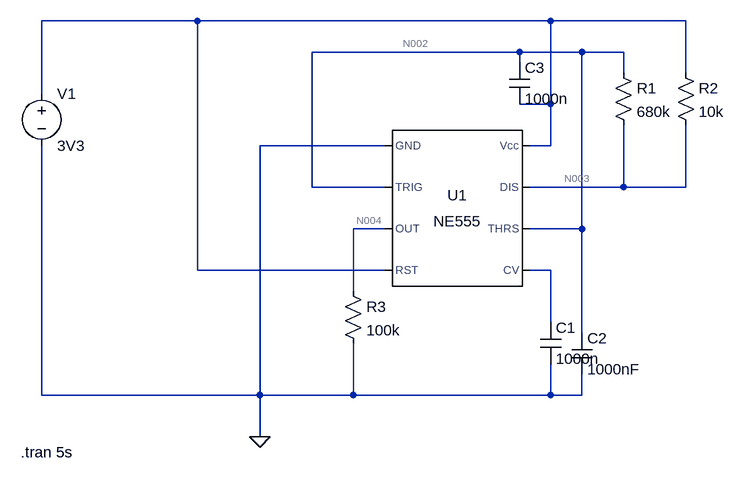
[diagram p0: schematic ts555-timer.asc]
ts555-timer.asc, the LTspice schematic file:
Version 4
SHEET 1 880 680
WIRE -224 -112 -464 -112
WIRE 320 -112 -224 -112
WIRE 528 -112 320 -112
WIRE 272 -64 -48 -64
WIRE 368 -64 272 -64
WIRE 432 -64 368 -64
WIRE 272 -48 272 -64
WIRE 432 -32 432 -64
WIRE 528 -32 528 -112
WIRE -464 0 -464 -112
WIRE 320 16 320 -112
WIRE 320 16 272 16
WIRE 64 80 -128 80
WIRE 320 80 320 16
WIRE 320 80 288 80
WIRE -48 144 -48 -64
WIRE 64 144 -48 144
WIRE 432 144 432 48
WIRE 432 144 288 144
WIRE 528 144 528 48
WIRE 528 144 432 144
WIRE 64 208 16 208
WIRE 368 208 368 -64
WIRE 368 208 288 208
WIRE -224 272 -224 -112
WIRE 64 272 -224 272
WIRE 320 272 288 272
WIRE 16 304 16 208
WIRE 320 352 320 272
WIRE 368 368 368 208
WIRE -464 464 -464 80
WIRE -128 464 -128 80
WIRE -128 464 -464 464
WIRE 16 464 16 384
WIRE 16 464 -128 464
WIRE 320 464 320 416
WIRE 320 464 16 464
WIRE 368 464 368 432
WIRE 368 464 320 464
WIRE -128 528 -128 464
FLAG -128 528 0
SYMBOL Misc\\NE555 176 176 R0
SYMATTR InstName U1
SYMBOL voltage -464 -16 R0
WINDOW 123 0 0 Left 2
WINDOW 39 0 0 Left 2
SYMATTR InstName V1
SYMATTR Value 3V3
SYMBOL cap 304 352 R0
SYMATTR InstName C1
SYMATTR Value 1000n
SYMBOL res 416 -48 R0
SYMATTR InstName R1
SYMATTR Value 680k
SYMBOL cap 352 368 R0
SYMATTR InstName C2
SYMATTR Value 1000nF
SYMBOL res 512 -48 R0
SYMATTR InstName R2
SYMATTR Value 10k
SYMBOL res 0 288 R0
SYMATTR InstName R3
SYMATTR Value 100k
SYMBOL cap 256 -48 R0
SYMATTR InstName C3
SYMATTR Value 1000n
TEXT -496 552 Left 2 !.tran 5s

The netlist it stands for:
* ts555-timer.asc
XU1 0 N002 N004 N001 N005 N002 N003 N001 NE555  ; pins GND TRIG OUT RST CV THRS DIS Vcc
V1 N001 0 3V3
C1 N005 0 1000n
R1 N002 N003 680k
C2 N002 0 1000nF
R2 N001 N003 10k
R3 N004 0 100k
C3 N002 N001 1000n
.tran 5s
.lib NE555.sub
.backanno
.end

* Results of the author's LTspice run, read from the files saved beside the schematic
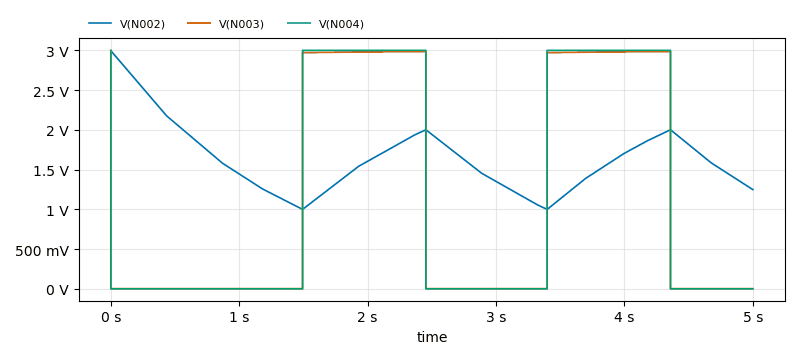
[diagram p1: Transient Analysis of ts555-timer.asc, plotted from the saved traces]
* Transient Analysis, 1 run:
*   V(N002): min 999 mV, max 2.996 V, average 1.622 V, rms 1.686 V, last 1.248 V
*   V(N003): min 1.808 mV, max 3 V, average 1.145 V, rms 1.846 V, last 1.81 mV
*   V(N004): min 18 µV, max 3 V, average 1.152 V, rms 1.859 V, last 18 µV